# EAGLE schematic 250_redraw (EAGLE 8.5.1)
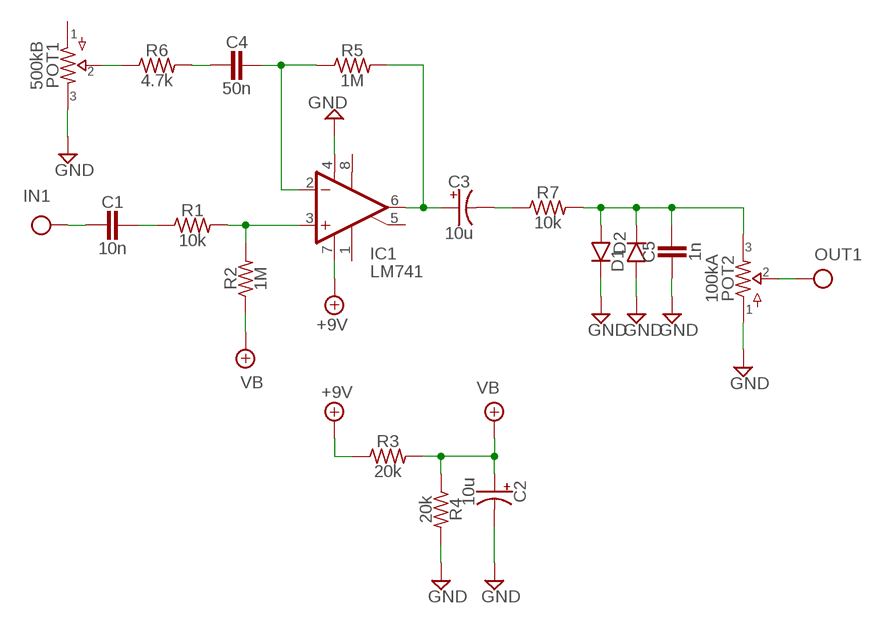
[diagram p0: schematic, sheet 1]

## Parts
C1  10n  CER/FILMBOX.1  [BOX_SMALL]
C2  10u  0500  [050_020]
C3  10u  0500  [050_020]
C4  50n  CER/FILMBOX.1  [BOX_SMALL]
C5  1n  CER/FILMBOX.1  [BOX_SMALL]
D1  DO35.2  [DO35-2]
D2  DO35.2  [DO35-2]
IC1  LM741  SINGLETH  [DIL0]
POT1  500kB  POTS16MM  [16MM]
POT2  100kA  POTS16MM  [16MM]
R1  10k  R_.3B  [R0207/3]
R2  1M  R_.3B  [R0207/3]
R3  20k  R_.3B  [R0207/3]
R4  20k  R_.3B  [R0207/3]
R5  1M  R_.3B  [R0207/3]
R6  4.7k  R_.3B  [R0207/3]
R7  10k  R_.3B  [R0207/3]

## Nets
+9V: IC1.7(V+) R3.1
GND: C2.- C5.2 D1.C D2.A IC1.4(V-) POT1.3 POT2.1 R4.2
IN: C1.2
N$4: C1.1 R1.1
N$5: IC1.3(+IN) R1.2 R2.2
N$7: C3.+ IC1.6(OUT) R5.2
N$8: C4.1 IC1.2(-IN) R5.1
N$10: POT1.2 R6.1
N$11: C4.2 R6.2
N$12: C5.1 D1.A D2.C POT2.3 R7.2
N$13: C3.- R7.1
OUT: POT2.2
VB: C2.+ R2.1 R3.2 R4.1
Unconnected: IC1.1(ON1) IC1.5(ON2) IC1.8(OPT) POT1.1

## Library data of the parts
C1 C4 C5 = pedals-capacitors-film:CER/FILM: 47 - 120pF Xicon Ceramic Disc 2.5mm lead spacing
C2 C3 = pedals-capacitors-elec:050
D1 D2 = pedals-diodes:DO35: DO-35 Package Diodes: 1N914
IC1 = pedals-integrated circuits:SINGLE: OP AMP
POT1 POT2 = pedals-potentiometers:POTS
R1-R7 = pedals-resistors:R_